# EAGLE design SIM808_Shield (EAGLE 6.5.0)
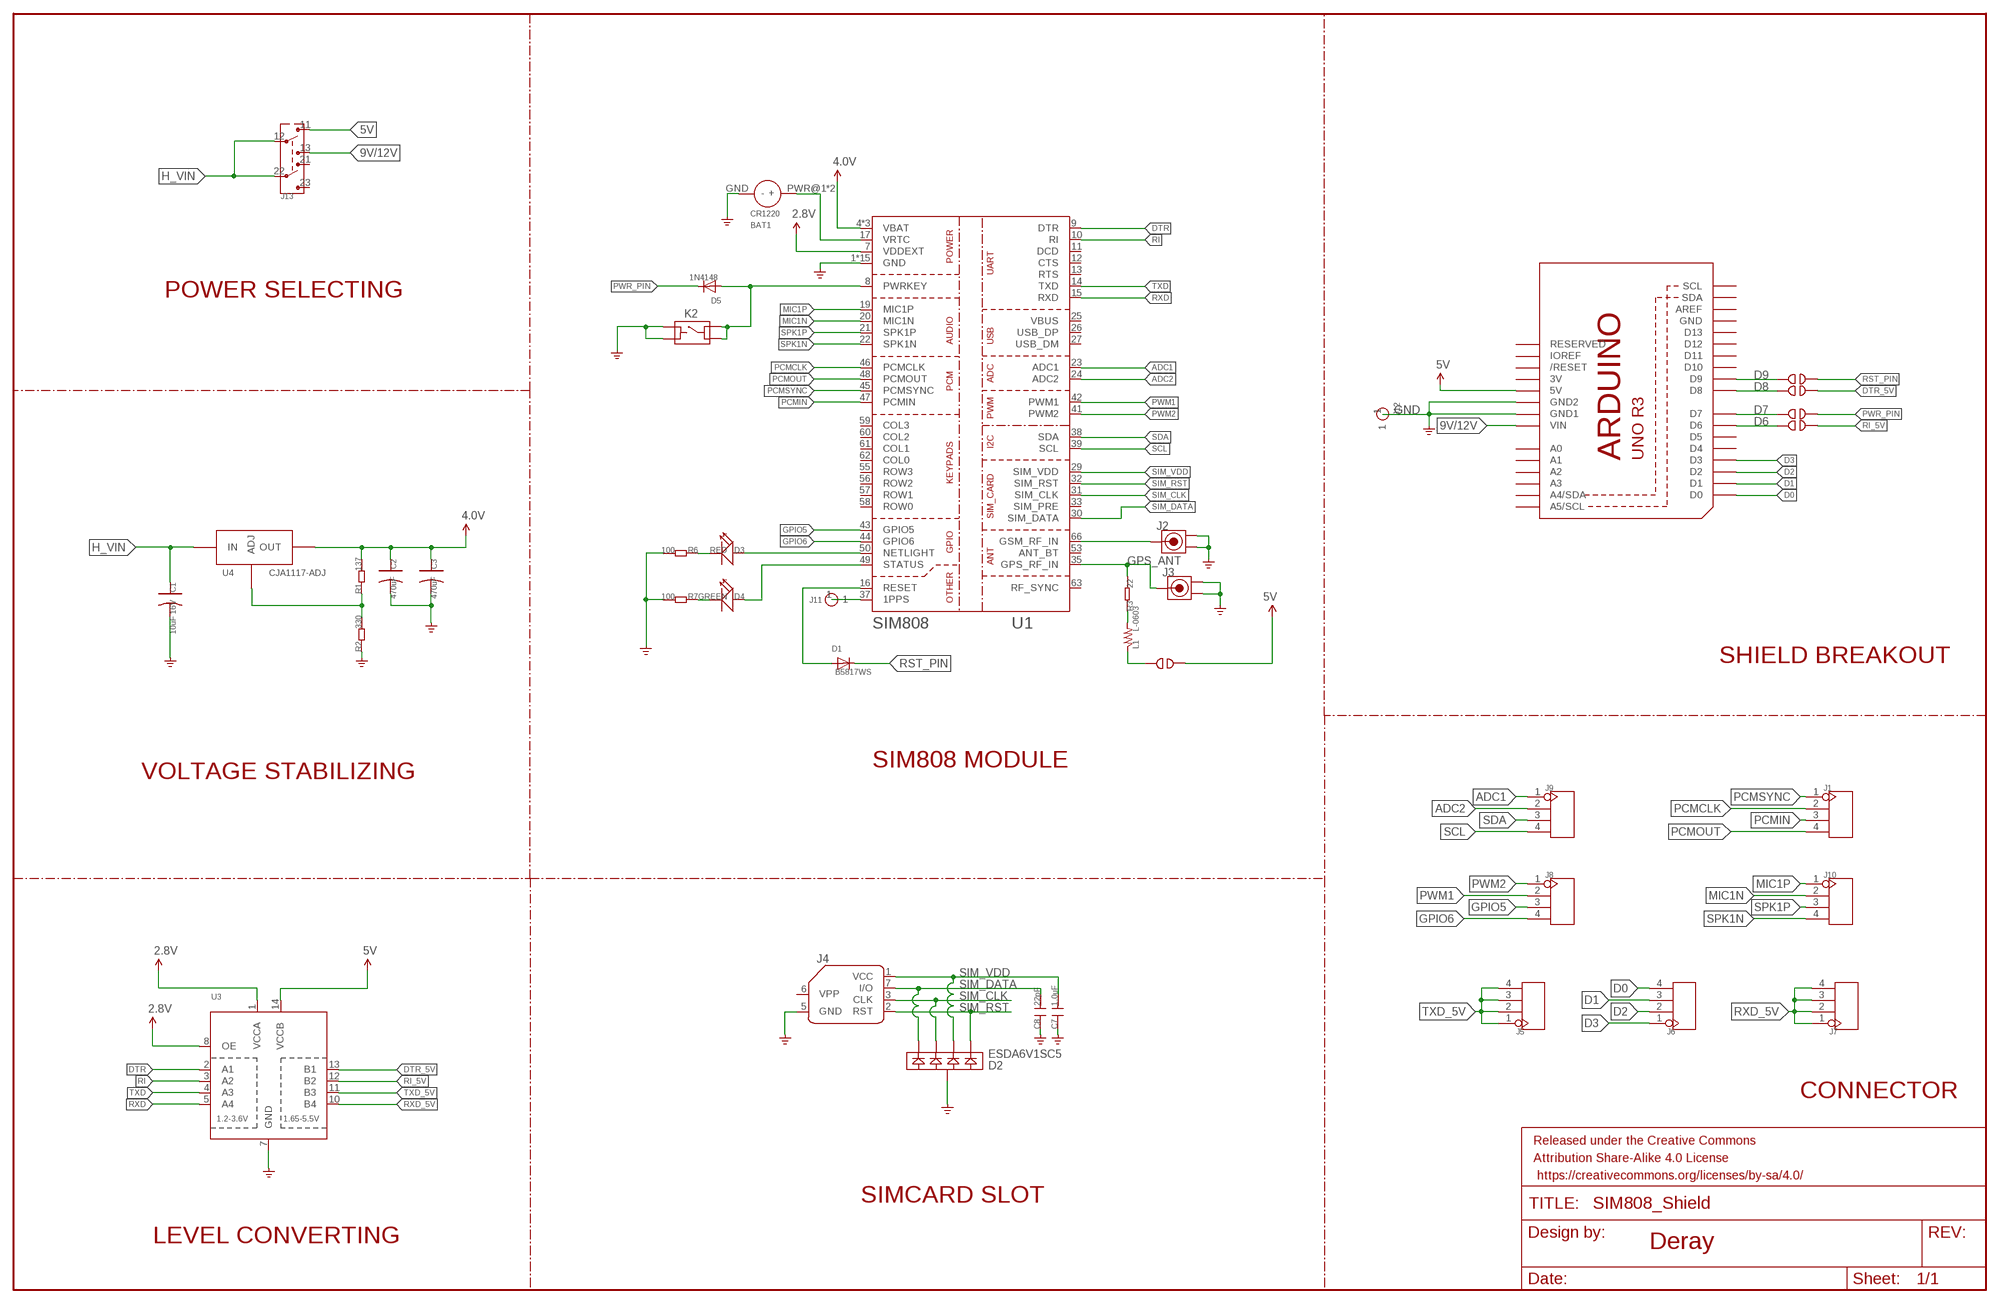
[diagram p0: schematic, sheet 1]

## Parts
BAT1  CR1220  BATTERY-3V  [BATTCON_12MM]
C1  10uF 16V  CAP-AVX-A  [AVX-A]
C2  470uF  CAP-AVX-D  [AVX-D]
C3  470uF  CAP-AVX-D  [AVX-D]
C7  1.0uF  C-0603  [0603]
C8  22pF  C-0603  [0603]
D1  B5817WS  DIODESOD-323F  [SOD-323F]
D2  ESDA6V1SC5  [SOT23-5L]
D3  RED  LED-0603  [0603]
D4  GREEN  LED-0603  [0603]
D5  1N4148  DIODESOD-323F  [SOD-323F]
J1  HEADER-4P-80/40MIL  [4P-2.54-80/40MIL]
J2  ANTENNA-U-FL'3PAD-TYPE'  [3P-U-FL]
J3  ANTENNA-U-FL'3PAD-TYPE'  [3P-U-FL]
J4  SIMHOLDERSIM  [SIMHOLDER]
J5  HEADER-4P-80/40MIL  [4P-2.54-80/40MIL]
J6  HEADER-4P-80/40MIL  [4P-2.54-80/40MIL]
J7  HEADER-4P-80/40MIL  [4P-2.54-80/40MIL]
J8  HEADER-4P-80/40MIL  [4P-2.54-80/40MIL]
J9  HEADER-4P-80/40MIL  [4P-2.54-80/40MIL]
J10  HEADER-4P-80/40MIL  [4P-2.54-80/40MIL]
J11  HEADER-1P-40  [1P-80/40MIL]
J12  HEADER-1P-40  [1P-80/40MIL]
J13  SWITCH-6P-SMD  [SWITCH-6P-SMD]
K2  BUTTON-4P-6X6-SMD  [4P-SMD-6.2X6.2X4H]
L1  L-0603  [0603]
R1  137  R-0603  [0603]
R2  330  R-0603  [0603]
R3  22  R-0603  [0603]
R6  100  R-0603  [0603]
R7  100  R-0603  [0603]
U1  SIM808  [68P-24X24X2.6]
U2  ARDUINOR3-DIMENSION  [ARDUINOR3]
U3  TXB0104PWR  [TSSOP14]
U4  CJA1117-ADJ  [SOT89]
U$8  2P-DISABLE  [2P-DISABLE]
U$17  2P-DISABLE  [2P-DISABLE]
U$18  2P-DISABLE  [2P-DISABLE]
U$19  2P-DISABLE  [2P-DISABLE]
U$20  2P-DISABLE  [2P-DISABLE]

## Nets
2.8V: U1.7(VDDEXT) U3.1(VCCA) U3.8(OE)
4.0V: C2.+ C3.+ R1.2 U1.4(VBAT) U1.5(VBAT) U1.6(VBAT) U4.2(OUT) U4.4(OUT)
5V: J13.11 U2.5V U3.14(VCCB) U$17.P$2
9V/12V: J13.13 U2.VIN
ADC1: J9.1 U1.23(ADC1)
ADC2: J9.2 U1.24(ADC2)
D0: J6.4 U2.D0
D1: J6.3 U2.D1
D2: J6.2 U2.D2
D3: J6.1 U2.D3
D6: U2.D6 U$20.P$1
D7: U2.D7 U$19.P$1
D8: U2.D8 U$18.P$1
D9: U2.D9 U$8.P$1
DTR: U1.9(DTR) U3.2(A1)
DTR_5V: U3.13(B1) U$18.P$2
GND: BAT1.GND(-) C1.- C2.- C3.- C7.1 C8.1 D2.2 J2.GND1 J2.GND2 J3.GND1 J3.GND2 J4.5(GND) J12.1 K2.2(B0) K2.3(B1) R2.1 R6.2 R7.2 U1.1(GND) U1.2(GND) U1.3(GND) U1.18(GND) U1.28(GND) U1.34(GND) U1.36(GND) U1.40(GND) U1.51(GND) U1.52(GND) U1.54(GND) U1.64(GND) U1.65(GND) U1.67(GND) U1.68(GND) U2.GND1 U2.GND2 U3.7(GND)
GPIO5: J8.3 U1.43(GPIO5)
GPIO6: J8.4 U1.44(GPIO6)
GPS_ANT: J3.D R3.2 U1.35(GPS_RF_IN)
H_VIN: C1.+ J13.12 J13.22 U4.3(IN)
MIC1N: J10.2 U1.20(MIC1N)
MIC1P: J10.1 U1.19(MIC1P)
N$1: BAT1.PWR@1(+) BAT1.PWR@2(+) U1.17(VRTC)
N$2: J2.D U1.66(GSM_RF_IN)
N$3: R1.1 R2.2 U4.1(ADJ)
N$4: D1.A U1.16(RESET)
N$5: J11.1 U1.37(1PPS)
N$9: D4.- R7.1
N$10: D5.A K2.1(A0) K2.4(A1) U1.8(PWRKEY)
N$11: D3.- R6.1
N$13: D4.+ U1.49(STATUS)
N$14: D3.+ U1.50(NETLIGHT)
N$15: L1.1 U$17.P$1
N$17: L1.2 R3.1
PCMCLK: J1.2 U1.46(PCMCLK)
PCMIN: J1.3 U1.47(PCMIN)
PCMOUT: J1.4 U1.48(PCMOUT)
PCMSYNC: J1.1 U1.45(PCMSYNC)
PWM1: J8.2 U1.42(PWM1)
PWM2: J8.1 U1.41(PWM2)
PWR_PIN: D5.C U$19.P$2
RI: U1.10(RI) U3.3(A2)
RI_5V: U3.12(B2) U$20.P$2
RST_PIN: D1.C U$8.P$2
RXD: U1.15(RXD) U3.5(A4)
RXD_5V: J7.1 J7.2 J7.3 J7.4 U3.10(B4)
SCL: J9.4 U1.39(SCL)
SDA: J9.3 U1.38(SDA)
SIM_CLK: D2.3 J4.3(CLK) U1.31(SIM_CLK)
SIM_DATA: C8.2 D2.1 J4.7(I/O) U1.30(SIM_DATA)
SIM_RST: D2.4 J4.2(RST) U1.32(SIM_RST)
SIM_VDD: C7.2 D2.5 J4.1(VCC) U1.29(SIM_VDD)
SPK1N: J10.4 U1.22(SPK1N)
SPK1P: J10.3 U1.21(SPK1P)
TXD: U1.14(TXD) U3.4(A3)
TXD_5V: J5.1 J5.2 J5.3 J5.4 U3.11(B3)
Unconnected: J4.6(VPP) J13.21 J13.23 U1.11(DCD) U1.12(CTS) U1.13(RTS) U1.25(VBUS) U1.26(USB_DP) U1.27(USB_DM) U1.33(SIM_PRE) U1.53(ANT_BT) U1.55(ROW3) U1.56(ROW2) U1.57(ROW1) U1.58(ROW0) U1.59(COL3) U1.60(COL2) U1.61(COL1) U1.62(COL0) U1.63(RF_SYNC) U2.A0 U2.A1 U2.A2 U2.A3 U2.A4(A4/SDA) U2.A5(A5/SCL) U2.AREF U2.D4 U2.D5 U2.D10 U2.D11 U2.D12 U2.D13 U2.IOREF U2.RESERVED U2.RESET(/RESET) U2.SCL U2.SDA

## Notes on the sheet
- POWER SELECTING
- SHIELD BREAKOUT
- SIM808 MODULE
- VOLTAGE STABILIZING
- CONNECTOR
- SIMCARD SLOT
- LEVEL CONVERTING | Deray

## Power pins joined to a net without a drawn wire
3V: U2.3V
GND: U2.GND

## Library data of the parts
BAT1 = Connector4:BATTERY-3V
C1-C3 = Common:CAP*
C7 C8 = Common:C*
D1 D5 = Semiconductors:DIODE: Diode SMADIODE - SMA Surface Mount Package 20V 1A Schottky Diode Digikey: 641-1014-6-ND DO-1N4148 - Through Hole Small Current Diode SOD-123 20V 1 A (.5mV Vf) Schottky Diode - Digikey: MBRX120TPMSCT-ND SOD-323 10V 570mA (.38mV Vf, 3ns) Schottky Diode - Digikey: ZLLS410CT-ND SOD-523 30V 30mA Schottky Diode (RB751S-40TE61) - Digikey: RB751S-40TE61CT-ND SOT23-R/W - SOT23 Package (R = Solder Paste/Reflow Ovens, W = Hand-Soldering) BAT54Film 40V 300mA - Digikey: 497-7162-1-ND
D2 = Semiconductors:ESDA6V1SC5: Quad Transil array for ESD protection STMicroelectronics http://www.st.com/internet/com/TECHNICAL_RESOURCES/TECHNICAL_LITERATURE/DATASHEET/CD00002055.pdf
D3 D4 = LEDs:LED*
J1 J5-J10 = Connector:HEADER-4P
J2 J3 = Connector:ANTENNA-U-FL
J4 = SparkFun-Connectors:SIMHOLDER: SIM Socket Socket for SIM cellular cards. Schematic element and footprint production proven. Spark Fun Electronics SKU : PRT-00548; PROD_ID: CONN-08536
J11 J12 = Connector:HEADER-1P
J13 = Buttons-Swithch:SWITCH-6P-SMD
K2 = Buttons-Swithch:BUTTON-4P
L1 = Common:L*
R1-R3 R6 R7 = Common:R*
U1 = SIMCOM:SIM808
U2 = adafruit:ARDUINOR3: This is a new object for the new Arduino R3 - with extra pins that you may want to use (such as IOref, and duplicated A4/A5
U3 = adafruit:TXB0104PWR: 4-Bit Bi-Directional Level Shifter 1.2V-3.6V (VCCA) to 1.65V-5.5V (VCCB) bi-directional level shifter with auto direction sensing. Max data rate - VCCA 1.8V: 20Mbps (50ns), VCCA 3.3V: 100Mbps (10ns) Digikey: 296-21929-1-ND
U4 = IC:CJA1117-ADJ
U$8 U$17-U$20 = Test-Pad:2P-DISABLE

## Net classes
0 default: width 0.203 mm

## Board
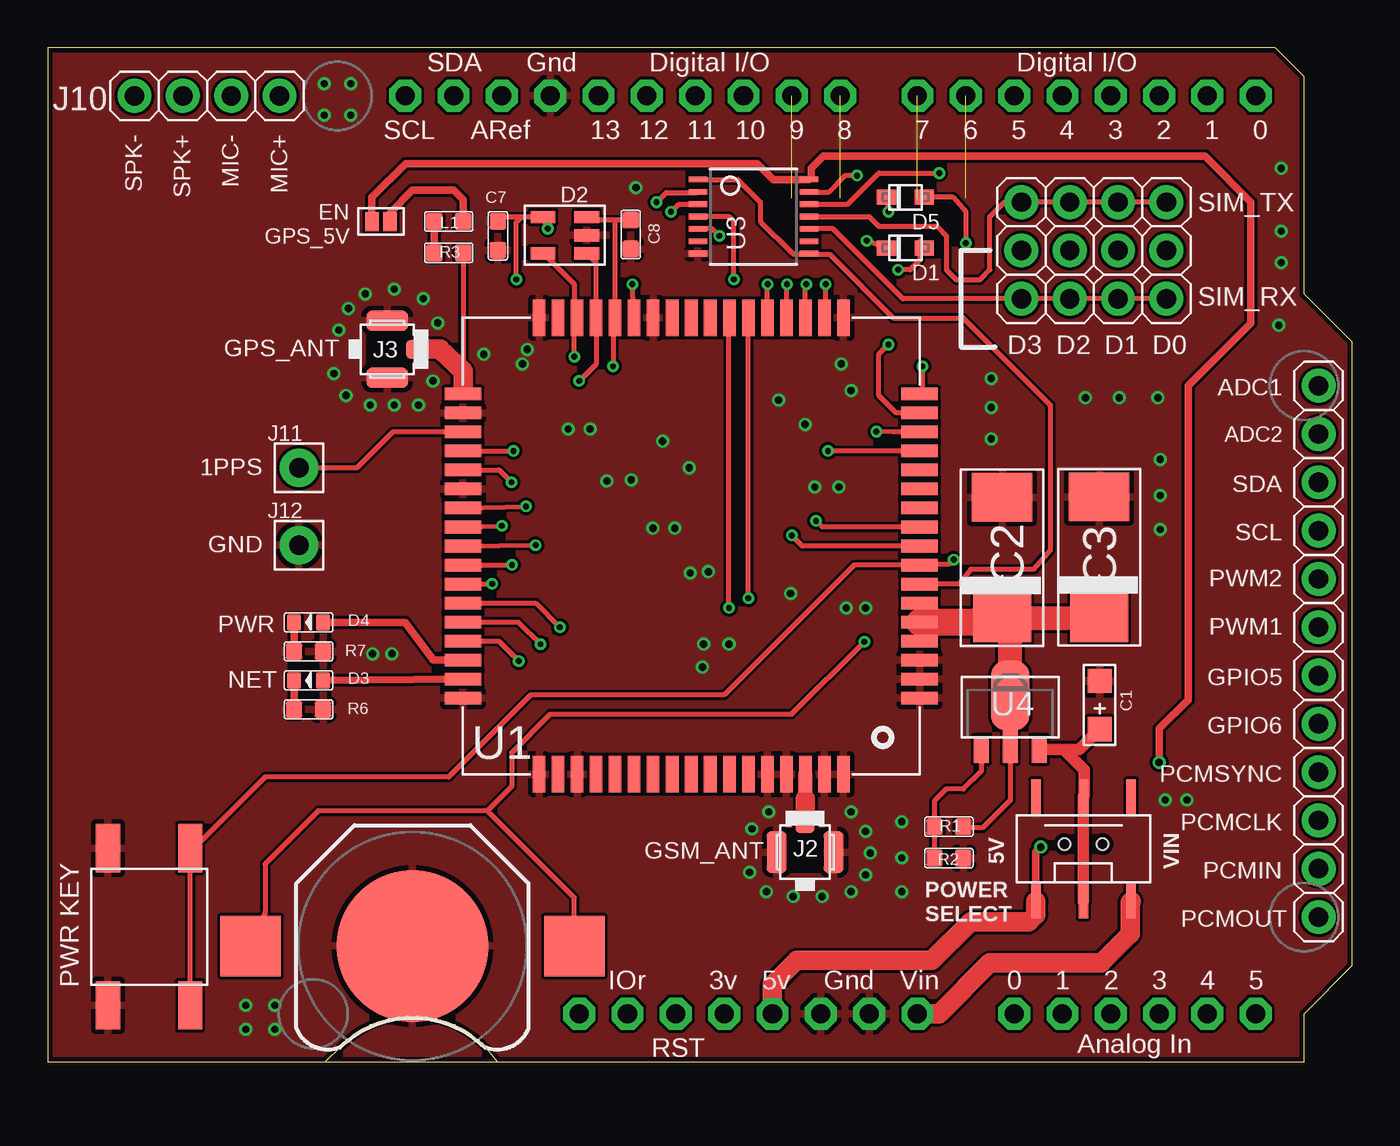
[diagram p1: board, top side]
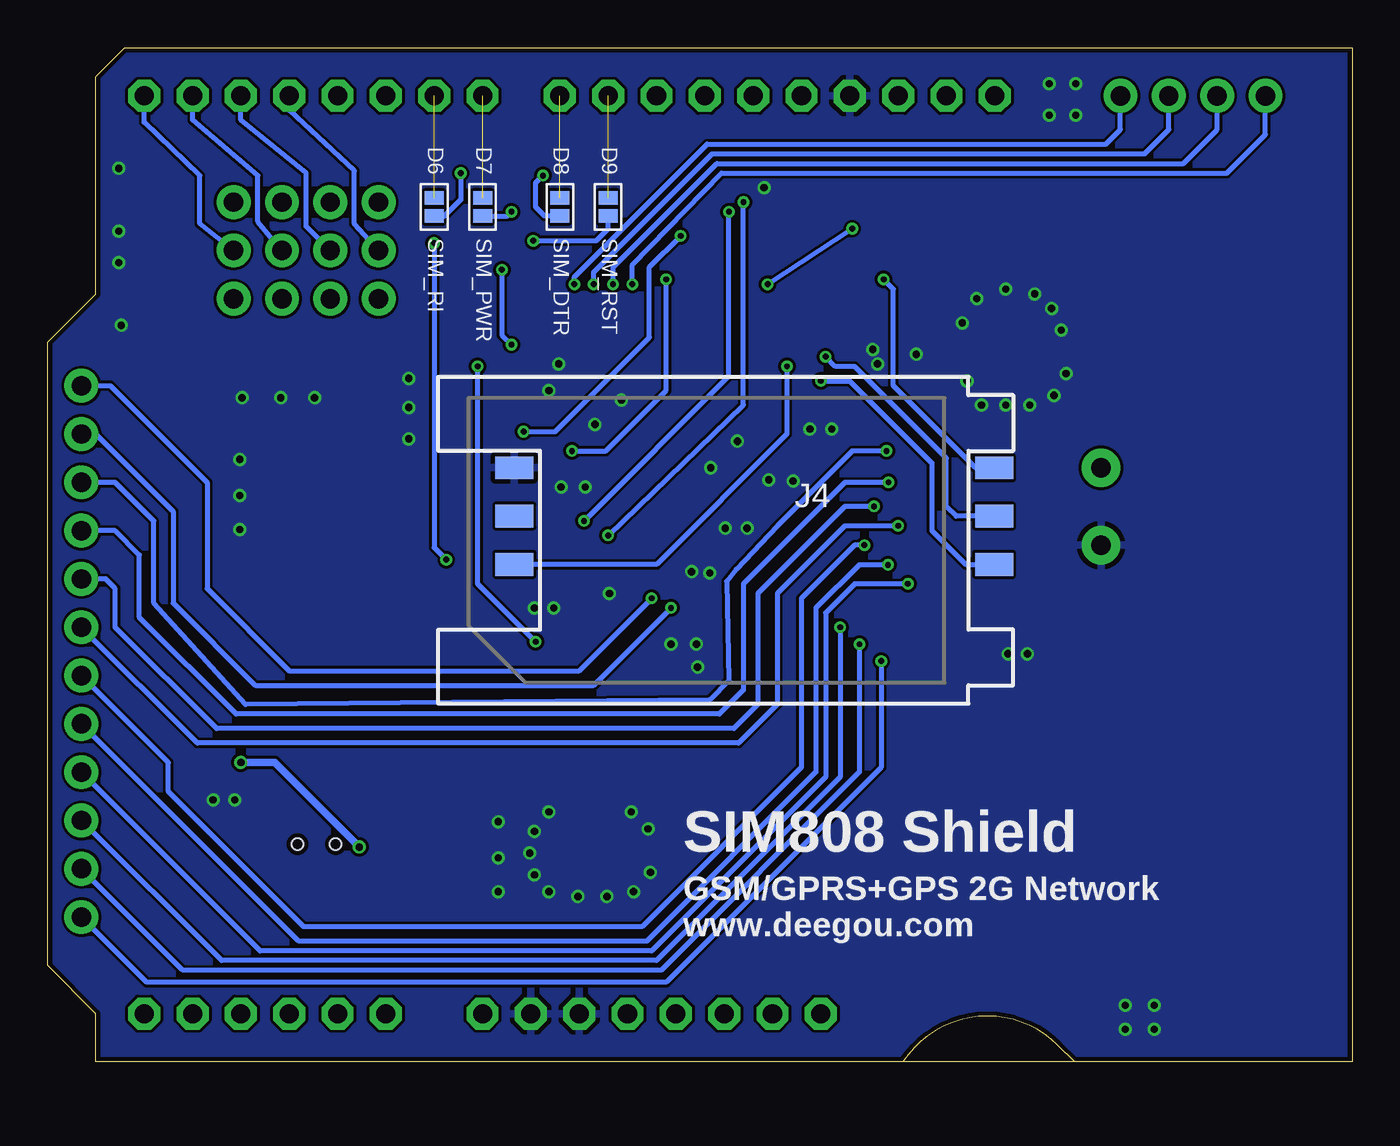
[diagram p2: board, bottom side, seen from below]

Size 68.58 x 53.34 mm. Coordinates in mm from the lower left corner, seen from the top.
Outline: 14.61,0 15.49,0.89 arc-45 19.18,2.41 arc-57 23.62,0
Copper layers (1*16): Top 0.035mm / dielectric 0.2mm / Bottom 0.035mm
Design rules "DRU *": minimum track width 6mil, minimum drill 12mil, track to track 6mil, track to pad 6mil, pad to pad 6mil, via to via 6mil, smd to smd 0mil, copper to edge 10mil, drill to drill 10mil, minimum pad ring 6mil, minimum via ring 6mil, stop-mask expansion 2mil, vias tented up to drill 25mil, thermal gap 10mil

### Footprints (pad centres in the part's own frame; a part is rotated, then mirrored left to right if it is on the bottom)
BATTCON_12MM = smd 8 x 8: GND 0,0 | smd 3.175 x 3.175: PWR@1 -8.509,0; PWR@2 8.509,0
AVX-A = smd 1.27 x 1.27: + -1.27,0; - 1.27,0
AVX-D = smd 2.54 x 3.048: + -3.175,0 | smd 2.54 x 3.175: - 3.175,0
0603 = smd 0.889 x 0.889: 1 -0.762,0; 2 0.762,0
SOD-323F = smd 1 x 0.8: A -1,0; C 1,0
SOT23-5L = smd 0.65 x 1.3: 1 0,1.15; 2 0.95,1.15; 3 1.9,1.15; 4 1.9,-1.15; 5 0,-1.15
0603' = smd 0.762 x 0.889: + -0.762,0; - 0.762,0
4P-2.54-80/40MIL = drill 1.016 pad 1.778: 1 0,3.81; 2 0,1.27; 3 0,-1.27; 4 0,-3.81
3P-U-FL = smd 1.05 x 1: D -1.524,0 | smd 2.2 x 1.05: GND1 0,1.5; GND2 0,-1.5
SIMHOLDER = smd 2 x 1.2: 1 -12.61,-3.81; 2 -12.61,-1.27; 3 -12.61,1.27; 5 12.61,-3.81; 6 12.61,-1.27; 7 12.61,1.27
1P-80/40MIL = drill 1.016 pad 2.032: 1 0,0
SWITCH-6P-SMD = smd 0.5 x 1.8: 11 0,-4.5; 12 2.5,-4.5; 13 5,-4.5; 21 0,1; 22 2.5,1; 23 5,1 | hole 0.6: 1.5,-1.5; 3.5,-1.5
4P-SMD-6.2X6.2X4H = smd 2.54 x 1.27: 1 -4.129,2.159; 2 -4.129,-2.159; 3 4.129,-2.159; 4 4.129,2.159
68P-24X24X2.6 = smd 1.93 x 0.66: 1 -12,8; 2 -12,7; 3 -12,6; 4 -12,5; 5 -12,4; 6 -12,3; 7 -12,2; 8 -12,1; 9 -12,0; 10 -12,-1; 11 -12,-2; 12 -12,-3; 13 -12,-4; 14 -12,-5; 15 -12,-6; 16 -12,-7; 17 -12,-8; 35 12,-8; 36 12,-7; 37 12,-6; 38 12,-5; 39 12,-4; 40 12,-3; 41 12,-2; 42 12,-1; 43 12,0; 44 12,1; 45 12,2; 46 12,3; 47 12,4; 48 12,5; 49 12,6; 50 12,7; 51 12,8 | smd 0.66 x 1.93: 18 -8,-12; 19 -7,-12; 20 -6,-12; 21 -5,-12; 22 -4,-12; 23 -3,-12; 24 -2,-12; 25 -1,-12; 26 0,-12; 27 1,-12; 28 2,-12; 29 3,-12; 30 4,-12; 31 5,-12; 32 6,-12; 33 7,-12; 34 8,-12; 52 8,12; 53 7,12; 54 6,12; 55 5,12; 56 4,12; 57 3,12; 58 2,12; 59 1,12; 60 0,12; 61 -1,12; 62 -2,12; 63 -3,12; 64 -4,12; 65 -5,12; 66 -6,12; 67 -7,12; 68 -8,12
ARDUINOR3 = drill 1 pad 1.676 octagon: 3V 35.56,2.54; 5V 38.1,2.54; A0 50.8,2.54; A1 53.34,2.54; A2 55.88,2.54; A3 58.42,2.54; A4 60.96,2.54; A5 63.5,2.54; AREF 23.876,50.8; D0 63.5,50.8; D1 60.96,50.8; D2 58.42,50.8; D3 55.88,50.8; D4 53.34,50.8; D5 50.8,50.8; D6 48.26,50.8; D7 45.72,50.8; D8 41.656,50.8; D9 39.116,50.8; D10 36.576,50.8; D11 34.036,50.8; D12 31.496,50.8; D13 28.956,50.8; GND 26.416,50.8; GND1 43.18,2.54; GND2 40.64,2.54; IOREF 30.48,2.54; RESERVED 27.94,2.54; RESET 33.02,2.54; SCL 18.796,50.8; SDA 21.336,50.8; VIN 45.72,2.54
TSSOP14 = smd 0.305 x 0.991: 1 -1.95,-2.918; 2 -1.3,-2.918; 3 -0.65,-2.918; 4 0,-2.918; 5 0.65,-2.918; 6 1.3,-2.918; 7 1.95,-2.918; 8 1.95,2.918; 9 1.3,2.918; 10 0.65,2.918; 11 0,2.918; 12 -0.65,2.918; 13 -1.3,2.918; 14 -1.95,2.918
SOT89 = smd 0.8 x 1.4: 1 -1.524,-1.905; 3 1.524,-1.905 | smd 0.8 x 1.9: 2 0,-1.651 | smd 2.032 x 3.65: 4 0,0.94
2P-DISABLE = smd 0.7 x 1: P$1 -0.473,0; P$2 0.473,0

### Placement (x,y rotation side)
BAT1  19.18,6.1 180 top
C1  55.3,18.77 90 top
C2  50.16,26.52 90 top
C3  55.27,26.54 90 top
C7  23.67,43.44 90 top
C8  30.65,43.51 90 top
D1  45.09,42.8 180 top
D2  27.19,44.42 270 top
D3  RED  [0603']  13.72,20.07 180 top
D4  GREEN  [0603']  13.72,23.11 180 top
D5  45.09,45.47 180 top
J1  66.8,11.43 0 top
J2  39.81,11.03 270 top
J3  17.85,37.48 180 top
J4  31.44,27.43 180 bottom
J5  54.99,45.21 90 top
J6  54.99,42.67 90 top
J7  54.99,40.13 90 top
J8  66.8,21.59 0 top
J9  66.8,31.75 0 top
J10  8.38,50.8 270 top
J11  13.21,31.24 0 top
J12  13.21,27.18 0 top
J13  51.94,12.95 0 top
K2  5.33,7.11 270 top
L1  21.08,44.2 180 top
R1  47.37,12.37 0 top
R2  47.37,10.72 180 top
R3  21.08,42.55 0 top
R6  13.72,18.54 0 top
R7  13.72,21.59 0 top
U1  33.83,27.13 180 top
U2  0,0 0 top
U3  37.1,44.45 270 top
U4  50.6,18.34 0 top
U$8  39.12,44.96 270 bottom
U$17  17.53,44.2 180 top
U$18  41.66,44.96 270 bottom
U$19  45.72,44.96 270 bottom
U$20  48.26,44.96 270 bottom

### Tracks (layer width: path | path; a pad name or v marks a point on that pad's centre or on a via)
2.8V
  Top 0.254: U3.1 36.28,46.4 37.47,45.21 37.47,44.2 39.12,42.55 39.14,42.55 39.22,42.47 39.98,42.47 | 39.98,42.47 U3.8 | 39.98,42.47 41.1,42.47 44.45,39.12 48.13,39.12 52.7,34.54 52.7,26.92 51.82,25.91 48.51,25.91 47.88,25.15 45.85,25.15 U1.7
4.0V
  Top 0.254: U4.4 U4.2 50.6,13.77 49.15,12.32 48.18,12.32 R1.2
  Top 0.406: U1.4 U1.5 U1.6
  Top 1.27: U4.4 50.6,23.16 C2.+ 53.47,23.34 C3.+
  Top 1.422: U1.5 49.7,23.13
  Top 1.676: 49.7,23.13 arc90 C2.+
5V  (via drill 0.38)
  Top 0.406: v58.42,15.75 58.42,17.53 59.94,19.05 59.94,35.56 63.25,38.86 63.25,45.21 60.83,47.62 40.77,47.62 40.13,46.99 40.13,46.52 U3.14 38.13,46.4 37.29,47.24 18.82,47.24 17.04,45.47 U$17.P$2 | 51.94,9.02 J13.11 51.94,11.05 v52.2,11.3
  Top 1.016: U2.5V 38.1,4.06 39.37,5.33 46.48,5.33 48.51,7.37 51.56,7.37 51.94,7.75 J13.11
  Bottom 0.406: v52.2,11.3 56.64,15.75 v58.42,15.75
9V/12V
  Top 1.016: U2.VIN 46.86,2.54 49.53,5.21 55.37,5.21 56.9,6.73 56.9,8.41 J13.13
ADC1  (via drill 0.3)
  Top 0.254: v36.83,24.38 U1.23
  Bottom 0.254: J9.1 65.28,35.56 60.2,30.48 60.2,24.89 55.88,20.57 40.64,20.57 v36.83,24.38
ADC2  (via drill 0.3)
  Top 0.254: v35.81,23.88 35.81,39.11 U1.24
  Bottom 0.254: J9.2 66.04,33.02 61.98,28.96 61.98,24.13 57.66,19.81 39.88,19.81 v35.81,23.88
D0
  Bottom 0.254: J6.4 60.58,44.07 60.58,46.61 63.5,49.4 U2.D0
D1
  Bottom 0.254: J6.3 57.53,44.2 57.53,46.61 60.96,49.53 U2.D1
D2
  Bottom 0.254: J6.2 54.99,43.94 54.99,46.74 58.42,49.53 U2.D2
D3
  Bottom 0.254: J6.1 52.45,44.07 52.45,46.86 55.88,50.04 U2.D3
D6  (1 unrouted)
D7  (1 unrouted)
D8  (1 unrouted)
D9  (1 unrouted)
DTR  (via drill 0.3)
  Top 0.254: U1.9 39.67,27.13 v39.12,27.69 | v32,45.21 32.51,45.72 34.15,45.72 U3.2
  Bottom 0.254: v39.12,27.69 32,34.54 v32,45.21
DTR_5V  (via drill 0.3)
  Top 0.254: v42.55,46.61 41.91,46.61 41.02,45.72 40.05,45.72 U3.13
  Bottom 0.254: U$18.P$2 42.45,44.48 42.93,44.96 42.93,46.23 v42.55,46.61
GND  (via drill 0.38)
  other vias: 32.32,32.64 33.78,25.72 34.42,20.76 35.81,21.97 29.4,30.54 34.73,25.78 41.97,23.88 19.49,34.54 18.22,34.54 16.95,34.54 15.68,35.05 20.51,38.86 19.75,40.13 18.22,40.64 16.7,40.39 15.81,39.62 15.3,38.48 15.05,36.2 20.26,35.81 34.48,21.97 32.96,28.07 30.67,30.61 27.37,33.27 31.81,28.07 33.72,31.24 39.05,24.64 42.23,35.31 42.99,23.88 40.32,30.23 41.59,30.23 28.51,33.27 39.81,33.53 38.42,34.8 41.72,36.7 18.1,21.46 22.92,37.21 25.21,37.47 24.96,36.7 10.41,2.98 10.41,1.71 11.94,2.98 11.94,1.71 37.91,13.14 37.02,12.26 36.89,9.97 37.78,8.95 39.18,8.7 40.7,8.7 42.23,8.95 42.99,9.84 43.24,10.99 42.99,12.13 42.23,13.14 44.89,8.95 30.92,45.97 49.59,35.94 49.59,34.42 58.36,34.92 56.32,34.92 54.55,34.92 64.83,43.69 64.83,42.04 64.83,46.99 64.71,38.73 49.59,32.77 44.89,12.64 44.89,10.73 58.74,13.78 59.88,13.78 58.48,28 58.48,31.69 58.48,29.78 14.54,51.44 15.94,51.44 15.94,49.78 14.54,49.78 17.08,21.46
  pour Top: -5,57 72,57 72,-5 -5,-5
  pour Bottom: -4.49,57.57 72.51,57.57 72.51,-4.43 -4.49,-4.43
GPIO5  (via drill 0.3)
  Top 0.254: U1.43 v25.65,27.18
  Bottom 0.254: v25.65,27.18 26.16,27.18 28.96,24.38 28.96,15.49 37.34,7.11 55.12,7.11 62.23,14.22 62.23,15.75 J8.3
GPIO6  (via drill 0.3)
  Top 0.254: U1.44 v24.41,26.14
  Bottom 0.254: v24.41,26.14 25.93,26.14 28.19,23.88 28.19,15.24 37.08,6.35 55.37,6.35 J8.4
GPS_ANT
  Top 0.254: 21.97,35.59 21.84,35.46 R3.2
  Top 0.61: U1.35 21.83,35.55 21.84,35.56
  Top 1.016: 21.84,35.46 21.84,35.56 21.84,36.32 21.49,36.68 20.68,37.44 20.85,37.26 20.63,37.49 J3.D
H_VIN
  Top 0.61: J13.12 J13.22 54.48,13.99 54.48,15.37 53.42,16.43 U4.3 54.23,16.43 C1.+
MIC1N  (via drill 0.3)
  Top 0.254: U1.20 39.83,40.85 v39.88,40.89
  Bottom 0.254: J10.2 9.65,49.02 10.92,47.75 33.66,47.75 39.88,41.53 v39.88,40.89
MIC1P  (via drill 0.3)
  Top 0.254: U1.19 40.89,39.19 v40.89,40.89
  Bottom 0.254: J10.1 12.19,49.02 12.95,48.26 33.91,48.26 40.89,41.27 v40.89,40.89
N$1  (via drill 0.3)
  Top 0.254: v42.93,22.1 39.12,18.29 26.42,18.29 24.38,16.26 24.38,14.48 23.11,13.21 | v45.97,36.58 45.97,35.27 U1.17 | 23.11,13.21 14.22,13.21 11.43,10.41 11.43,7.87 BAT1.PWR@2 | BAT1.PWR@1 27.69,8.64 23.11,13.21
  Bottom 0.254: v42.93,22.1 45.97,25.15 v45.97,36.58
N$2
  Top 0.762: U1.66 39.83,13.84 | 39.83,12.55 39.83,12.59 J2.D
  Top 1.016: 39.83,13.84 39.83,12.55
N$3
  Top 0.254: U4.1 49.07,15.29 48.13,14.35 47.24,14.35 46.61,13.72 R1.1 R2.2
N$4  (via drill 0.3)
  Top 0.254: U1.16 44.61,34.13 43.69,35.05 43.69,37.21 v44.2,37.72 | D1.A 45.85,43.18 45.85,42.16 45.34,41.66 v44.7,41.66
  Bottom 0.254: v44.7,41.66 44.7,38.23 v44.2,37.72
N$5
  Top 0.254: U1.37 18.14,33.13 16.26,31.24 J11.1
N$9
  Top 0.406: D4.- R7.1
N$10  (via drill 0.3)
  Top 0.254: K2.1 7.75,10.67 7.49,10.92 7.37,10.92 11.43,14.99 21.08,14.99 25.4,19.3 35.56,19.3 42.39,26.13 U1.8 45.86,26.16 47.37,26.16 v47.62,26.42 | D5.A 47.61,45.47 48.26,44.7 v48.26,43.05 | K2.4 K2.1 | K2.1 7.49,11.81
  Bottom 0.254: v48.26,43.05 48.26,27.05 v47.62,26.42
N$11
  Top 0.406: D3.- R6.1
N$13
  Top 0.406: U1.49 20.27,21.13 18.8,23.11 D4.+
N$14
  Top 0.406: U1.50 21.65,20.13 D3.+
N$15
  Top 0.406: U$17.P$1 18,44.67 19.18,45.85 21.34,45.85 21.84,45.34 L1.1
N$17
  Top 0.406: L1.2 R3.1
PCMCLK  (via drill 0.3)
  Top 0.254: U1.46 25.65,24.13 v26.92,22.86
  Bottom 0.254: v26.92,22.86 26.92,14.99 36.58,5.33 59.44,5.33 J1.2
PCMIN  (via drill 0.3)
  Top 0.254: U1.47 24.75,23.13 v25.91,21.97
  Bottom 0.254: v25.91,21.97 25.91,15.24 36.32,4.83 61.47,4.83 J1.3
PCMOUT  (via drill 0.3)
  Top 0.254: U1.48 23.72,22.13 v24.77,21.08
  Bottom 0.254: v24.77,21.08 24.77,15.49 36.07,4.19 63.37,4.19 J1.4
PCMSYNC  (via drill 0.3)
  Top 0.254: U1.45 23.35,25.13 v23.37,25.15
  Bottom 0.254: v23.37,25.15 26.16,25.15 27.69,23.62 27.69,14.99 36.83,5.84 57.4,5.84 J1.1
PWM1  (via drill 0.3)
  Top 0.254: U1.42 v23.88,28.19
  Bottom 0.254: v23.88,28.19 26.67,28.19 30.23,24.64 30.23,18.8 32.26,16.76 60.71,16.76 J8.2
PWM2  (via drill 0.3)
  Top 0.254: U1.41 v25.15,29.21
  Bottom 0.254: v25.15,29.21 26.67,29.21 31.24,24.64 31.24,18.8 32.51,17.53 59.69,17.53 65.02,22.86 65.02,24.89 65.53,25.4 J8.1
PWR_PIN  (via drill 0.3)
  Top 0.254: 43.96,45.74 D5.C 44.2,45.45 v44.2,44.7
  Bottom 0.254: U$19.P$2 44.41,44.48 v44.2,44.7
RI  (via drill 0.3)
  Top 0.254: U1.10 40.7,28.13 v40.39,28.45 | v32.77,44.7 33.16,45.1 U3.3
  Bottom 0.254: v40.39,28.45 32.77,36.07 v32.77,44.7
RI_5V  (via drill 0.3)
  Top 0.254: U3.12 42.05,45.1 43.69,46.74 v46.86,46.74
  Bottom 0.254: v46.86,46.74 46.86,45.34 47.75,44.45 48.23,44.45 U$20.P$2
RST_PIN  (via drill 0.3)
  Top 0.254: D1.C v43.05,43.18
  Bottom 0.254: v43.05,43.18 39.75,43.18 39.12,43.81 U$8.P$2
RXD  (via drill 0.3)
  Top 0.254: U1.15 44.47,33.13 v43.56,33.15 | v35.31,43.43 34.92,43.81 34.2,43.81 U3.5
  Bottom 0.254: v43.56,33.15 41.91,33.15 36.96,38.1 36.96,41.78 v35.31,43.43
RXD_5V
  Top 0.254: J7.4 J7.3 J7.2 J7.1 44.96,40.13 41.27,43.81 40.03,43.81 U3.10
SCL  (via drill 0.3)
  Top 0.254: U1.39 23.73,31.13 v24.38,30.48
  Bottom 0.254: v24.38,30.48 26.67,30.48 32,25.15 32,19.56 33.27,18.29 58.67,18.29 63.75,23.37 63.75,26.67 65.02,27.94 J9.4
SDA  (via drill 0.3)
  Top 0.254: U1.38 v24.49,32.13
  Bottom 0.254: v24.49,32.13 26.29,32.13 30.23,28.19 32.38,25.91 32.89,25.27 32.77,20.07 33.78,19.05 58.17,18.8 62.99,24.13 62.99,28.45 65.02,30.48 J9.3
SIM_CLK  (via drill 0.3)
  Top 0.254: D2.3 28.83,42.03 U1.31 28.83,36.7 v27.94,35.81
  Bottom 0.254: v27.94,35.81 26.42,35.81 22.1,31.5 22.1,27.94 20.32,26.16 J4.3
SIM_DATA  (via drill 0.3)
  Top 0.254: C8.2 29.84,44.27 | 29.84,44.27 28.49,44.27 D2.1 | 29.84,44.27 29.83,44.26 U1.30 29.72,39.13 v29.72,36.58
  Bottom 0.254: v29.72,36.58 29.72,33.02 36.58,26.16 J4.7 | 44.7,26.16 J4.7 | J4.7
SIM_RST  (via drill 0.3)
  Top 0.254: D2.4 26.06,42.52 27.69,40.89 27.69,39.27 U1.32 27.69,38.99 v27.69,37.08
  Bottom 0.254: J4.2 20.83,28.7 21.34,29.21 21.34,31.75 26.16,36.58 27.18,36.58 v27.69,37.08
SIM_VDD  (via drill 0.3)
  Top 0.254: 24.89,44.42 D2.5 26.29,43.92 v26.29,43.81 | 24.89,44.42 23.88,44.42 C7.2 | U1.29 v30.73,40.89 | v24.64,41.15 24.64,44.17 24.89,44.42
  Bottom 0.254: v30.73,40.89 v26.29,43.81 | J4.1 19.81,31.24 24.13,35.56 24.13,40.64 v24.64,41.15
SPK1N  (via drill 0.3)
  Top 0.254: U1.22 37.83,40.88 v37.85,40.89
  Bottom 0.254: J10.4 4.57,48.77 6.6,46.74 33.15,46.74 37.85,41.91 v37.85,40.89
SPK1P  (via drill 0.3)
  Top 0.254: U1.21 v38.86,40.89
  Bottom 0.254: J10.3 7.11,49.02 8.89,47.24 33.4,47.24 38.86,41.78 v38.86,40.89
TXD  (via drill 0.3)
  Top 0.254: U1.14 41.53,32.13 v41.02,32.13 | v36.07,41.15 36.07,44.07 arc90 35.69,44.45 U3.4 arc-90 U3.4
  Bottom 0.254: v41.02,32.13 39.24,32.13 36.07,35.31 v36.07,41.15
TXD_5V
  Top 0.254: J5.4 J5.3 J5.2 J5.1 50.29,45.21 49.53,44.45 49.53,41.66 49.02,41.15 47.75,41.15 47.24,41.66 47.24,43.43 46.74,43.94 43.69,43.94 43.18,44.45 U3.11

### Text on the board
tPlace: SPK- | SPK+ | MIC- | MIC+ | EN | SIM_TX | GPS_5V | SIM_RX | GPS_ANT | D3 | D2 | D1 | D0 | ADC1 | ADC2 | 1PPS | SDA | GND | SCL | PWM2 | PWR | PWM1 | NET | GPIO5 | GPIO6 | PCMSYNC | PCMCLK | VIN | GSM_ANT | PCMIN | 5V | POWER | PCMOUT | SELECT | PWR KEY
bPlace: D9 | D8 | D7 | D6 | SIM_RST | SIM_DTR | SIM_PWR | SIM_RI | SIM808 Shield | GSM/GPRS+GPS 2G Network | www.deegou.com